# EasyEDA schematic car_plot.json
TITLE: car plot; REV: 1.0; Date: 2025-03-12; Sheet: 1/1; Drawn By: nath8505; Company: Your Company
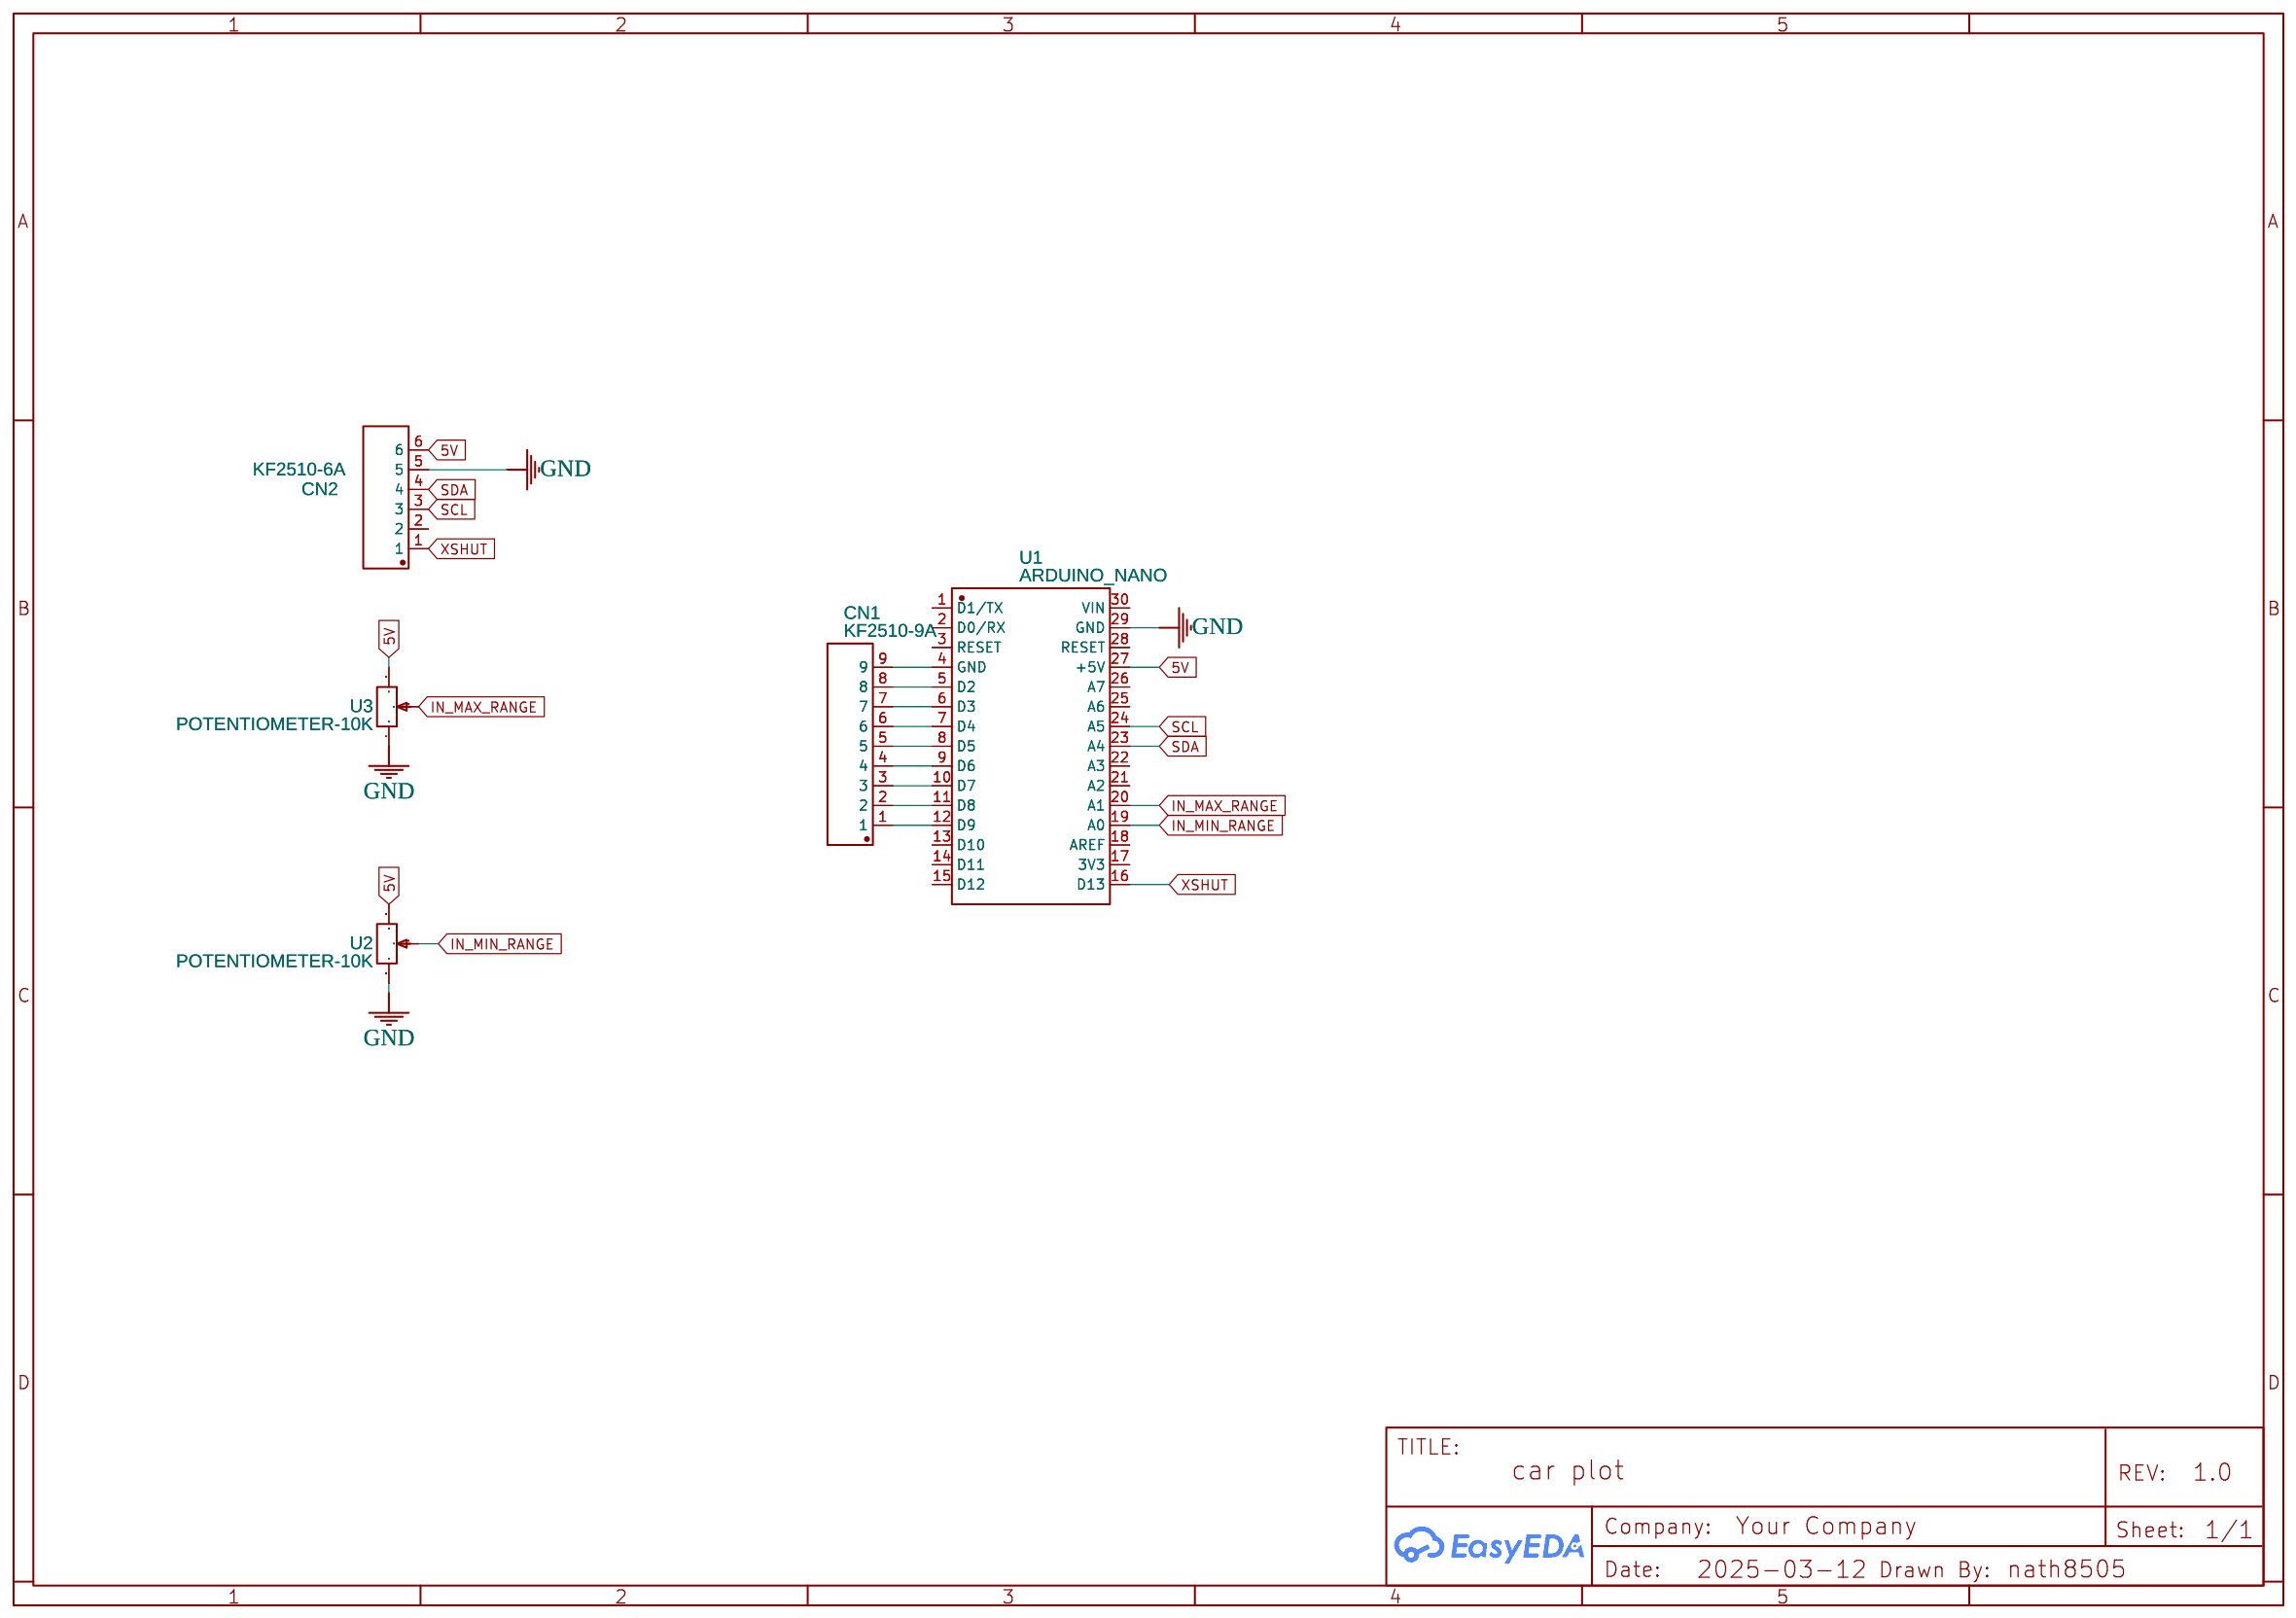
[diagram p0: schematic sheet]

## Parts
CN1  KF2510-9A  [CONN-TH_KF2510-9A]
CN2  KF2510-6A  [CONN-TH_KF2510-6A]
U1  ARDUINO_NANO  [COMM-TH_ARDUINO_NANO]
U2  POTENTIOMETER-10K  [RES-ADJ-SMD_VG039NCH]
U3  POTENTIOMETER-10K  [RES-ADJ-SMD_VG039NCH]

## Library data of the parts
CN1 = KF2510-9A: Supplier: LCSC; Manufacturer: BOOMELE(博穆精密); Manufacturer Part: 2510-9A; Supplier Part: C36635; JLCPCB Part Class: Extended Part
CN2 = KF2510-6A: Supplier Part: C27545; Supplier: LCSC; Manufacturer: null; Manufacturer Part: KF2510-6A针座; JLCPCB Part Class: Extended Part
U1 = ARDUINO_NANO: Contributor: lcsc; Supplier: LCSC; Supplier Part: C9900017879; Manufacturer: null; JLCPCB Part Class: Extended Part
U2 U3 = 3*3POTENTIOMETER-10KΩ20%: Contributor: LCSC; Supplier: LCSC; Supplier Part: C9900010776; Manufacturer: null; Manufacturer Part: 3*3Potentiometer-10kΩ20%; JLCPCB Part Class: Extended Part

## Nets
5V: CN2.6 U1.27(+5V) U2.3 U3.3
GND: CN2.5 U1.29(GND) U2.1 U3.1
IN_MAX_RANGE: U1.20(A1) U3.2
IN_MIN_RANGE: U1.19(A0) U2.2
SCL: CN2.3 U1.24(A5)
SDA: CN2.4 U1.23(A4)
XSHUT: CN2.1 U1.16(D13)
Net-(CN1-1): CN1.1 U1.12(D9)
Net-(CN1-2): CN1.2 U1.11(D8)
Net-(CN1-3): CN1.3 U1.10(D7)
Net-(CN1-4): CN1.4 U1.9(D6)
Net-(CN1-5): CN1.5 U1.8(D5)
Net-(CN1-6): CN1.6 U1.7(D4)
Net-(CN1-7): CN1.7 U1.6(D3)
Net-(CN1-8): CN1.8 U1.5(D2)
Net-(CN1-9): CN1.9 U1.4(GND)

Not connected (* = marked no-connect by the designer): CN2 2; U1 1(D1/TX) 2(D0/RX) 3(RESET) 13(D10) 14(D11) 15(D12) 17(3V3) 18(AREF) 21(A2) 22(A3) 25(A6) 26(A7) 28(RESET) 30(VIN)
